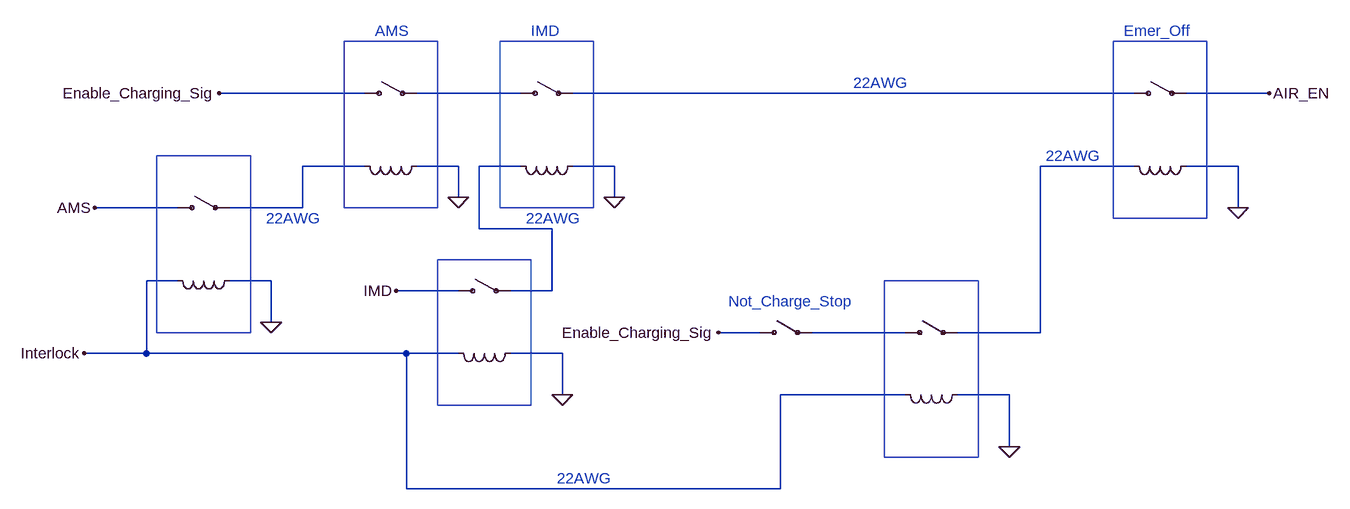
[diagram p0: schematic Charging Shutdown Circuit Schematic RM27.asc]
Charging Shutdown Circuit Schematic RM27.asc, the LTspice schematic file:
Version 4
SHEET 1 1356 680
WIRE -144 -224 -368 -224
WIRE 96 -224 -64 -224
WIRE 1040 -224 176 -224
WIRE 1248 -224 1120 -224
WIRE -144 -112 -240 -112
WIRE 0 -112 -64 -112
WIRE 96 -112 32 -112
WIRE 240 -112 176 -112
WIRE 1040 -112 896 -112
WIRE 1200 -112 1120 -112
WIRE 0 -64 0 -112
WIRE 240 -64 240 -112
WIRE -432 -48 -560 -48
WIRE -240 -48 -240 -112
WIRE -240 -48 -352 -48
WIRE 1200 -48 1200 -112
WIRE 32 -16 32 -112
WIRE 144 -16 32 -16
WIRE -432 64 -480 64
WIRE -288 64 -352 64
WIRE 0 80 -96 80
WIRE 144 80 144 -16
WIRE 144 80 80 80
WIRE -288 128 -288 64
WIRE 464 144 400 144
WIRE 688 144 544 144
WIRE 896 144 896 -112
WIRE 896 144 768 144
WIRE -480 176 -480 64
WIRE -480 176 -576 176
WIRE -80 176 -480 176
WIRE 0 176 -80 176
WIRE 160 176 80 176
WIRE 160 240 160 176
WIRE 688 240 496 240
WIRE 848 240 768 240
WIRE 848 320 848 240
WIRE -80 384 -80 176
WIRE 496 384 496 240
WIRE 496 384 -80 384
FLAG -368 -224 Enable_Charging_Sig
FLAG 0 -64 0
FLAG 240 -64 0
FLAG -96 80 IMD
FLAG 160 240 0
FLAG -288 128 0
FLAG -560 -48 AMS
FLAG -576 176 Interlock
FLAG 400 144 Enable_Charging_Sig
FLAG 848 320 0
FLAG 1248 -224 AIR_EN
FLAG 1200 -48 0
SYMBOL ind -48 -128 R90
WINDOW 0 5 56 Invisible 2
WINDOW 3 32 56 Invisible 2
SYMATTR InstName L1
SYMBOL ind 192 -128 R90
WINDOW 0 5 56 Invisible 2
WINDOW 3 32 56 Invisible 2
SYMATTR InstName L2
SYMBOL csw -144 -224 R270
WINDOW 0 32 40 Invisible 2
WINDOW 3 -32 40 Invisible 2
SYMATTR InstName W1
SYMBOL csw 96 -224 R270
WINDOW 0 32 40 Invisible 2
WINDOW 3 -32 40 Invisible 2
SYMATTR InstName W2
SYMBOL csw 0 80 R270
WINDOW 0 32 40 Invisible 2
WINDOW 3 -32 40 Invisible 2
SYMATTR InstName W4
SYMBOL ind 96 160 R90
WINDOW 0 5 56 Invisible 2
WINDOW 3 32 56 Invisible 2
SYMATTR InstName L4
SYMBOL ind -336 48 R90
WINDOW 0 -9 70 Invisible 2
WINDOW 3 32 56 Invisible 2
SYMATTR InstName L5
SYMBOL csw -432 -48 R270
WINDOW 0 32 40 Invisible 2
WINDOW 3 -32 40 Invisible 2
SYMATTR InstName W5
SYMBOL csw 464 144 R270
WINDOW 0 32 40 Invisible 2
WINDOW 3 -32 40 Invisible 2
SYMATTR InstName W6
SYMBOL csw 688 144 R270
WINDOW 0 32 40 Invisible 2
WINDOW 3 -32 40 Invisible 2
SYMATTR InstName W7
SYMBOL ind 784 224 R90
WINDOW 0 5 56 Invisible 2
WINDOW 3 32 56 Invisible 2
SYMATTR InstName L6
SYMBOL ind 1136 -128 R90
WINDOW 0 5 56 Invisible 2
WINDOW 3 32 56 Invisible 2
SYMATTR InstName L3
SYMBOL csw 1040 -224 R270
WINDOW 0 32 40 Invisible 2
WINDOW 3 -32 40 Invisible 2
SYMATTR InstName W3
TEXT 608 -240 Left 2 ;22AWG
TEXT 904 -128 Left 2 ;22AWG
TEXT 152 368 Left 2 ;22AWG
TEXT 104 -32 Left 2 ;22AWG
TEXT -296 -32 Left 2 ;22AWG
TEXT 1024 -320 Left 2 ;Emer_Off
TEXT 416 96 Left 2 ;Not_Charge_Stop
TEXT -128 -320 Left 2 ;AMS
TEXT 112 -320 Left 2 ;IMD
RECTANGLE Normal -32 -48 -176 -304
RECTANGLE Normal 208 -304 64 -48
RECTANGLE Normal 112 256 -32 32
RECTANGLE Normal -320 144 -464 -128
RECTANGLE Normal 800 336 656 64
RECTANGLE Normal 1152 -32 1008 -304

The netlist it stands for:
* Charging Shutdown Circuit Schematic RM27.asc
L1 0 N003 L
L2 0 N004 L
W1 Enable_Charging_Sig N001 CSW
W2 N001 N002 CSW
W4 IMD N004 CSW
L4 0 Interlock L
L5 0 Interlock L
W5 AMS N003 CSW
W6 Enable_Charging_Sig N006 CSW
W7 N006 N005 CSW
L6 0 Interlock L
L3 0 N005 L
W3 N002 AIR_EN CSW
* 22AWG
* 22AWG
* 22AWG
* 22AWG
* 22AWG
* Emer_Off
* Not_Charge_Stop
* AMS
* IMD
.backanno
.end